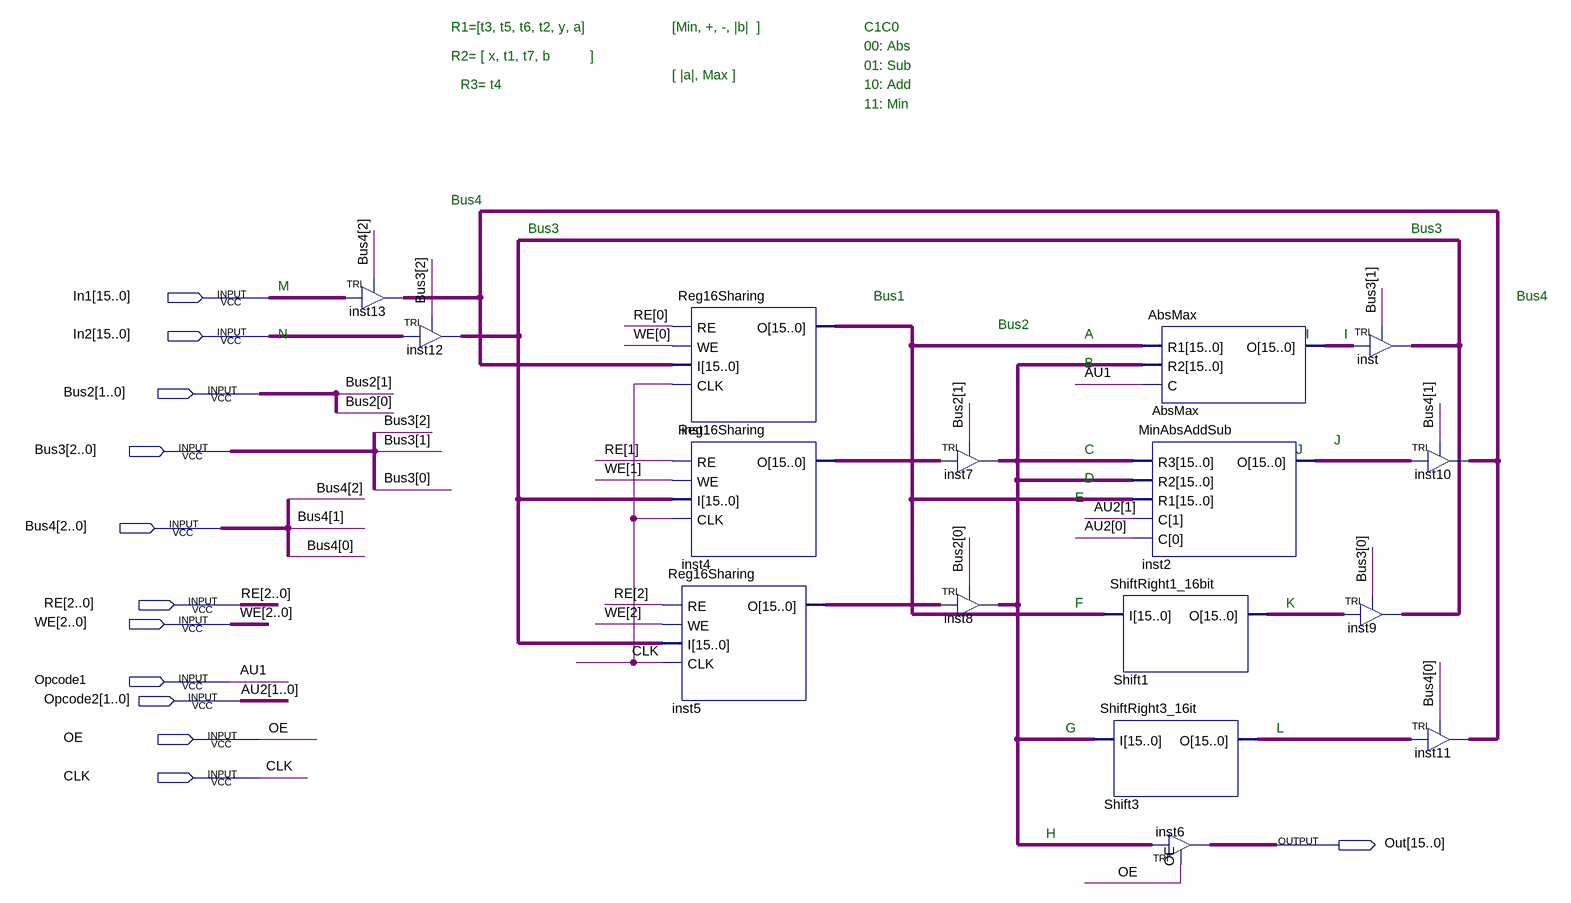
[diagram p0: schematic sheet]
// Quartus schematic BusSharingDatapath.bdf as structural Verilog: 16 symbols, 12 pins
module BusSharingDatapath (
  input  [15:0] In1,
  input  [15:0] In2,
  input  [1:0] Bus2,
  input  [2:0] Bus3,
  input  [2:0] Bus4,
  input  [2:0] RE,
  input  [2:0] WE,
  input  Opcode1,
  input  [1:0] Opcode2,
  input  OE,
  input  CLK,
  output [15:0] Out
);

  wire [15:0] AbsMax_o, inst1_o, inst2_o, inst4_o, inst5_o, inst7_out, inst12_out, inst13_out, Shift1_o,
       Shift3_o;

  TRI inst13[15:0] (.IN(In1), .OE(Bus4[2]), .OUT(inst13_out));
  TRI inst12[15:0] (.IN(In2), .OE(Bus3[2]), .OUT(inst12_out));
  Reg16Sharing inst1 (.RE(RE[0]), .WE(WE[0]), .I(inst13_out), .CLK(CLK), .O(inst1_o));
  Reg16Sharing inst4 (.RE(RE[1]), .WE(WE[1]), .I(inst12_out), .CLK(CLK), .O(inst4_o));
  Reg16Sharing inst5 (.RE(RE[2]), .WE(WE[2]), .I(inst12_out), .CLK(CLK), .O(inst5_o));
  TRI inst7[15:0] (.IN(inst4_o), .OE(Bus2[1]), .OUT(inst7_out));
  TRI inst8[15:0] (.IN(inst5_o), .OE(Bus2[0]), .OUT(inst7_out));
  ShiftRight1_16bit Shift1 (.I(inst1_o), .O(Shift1_o));
  ShiftRight3_16it Shift3 (.I(inst7_out), .O(Shift3_o));
  AbsMax AbsMax (.R1(inst1_o), .R2(inst7_out), .C(Opcode1), .O(AbsMax_o));
  MinAbsAddSub inst2 (.R3(inst7_out), .R2(inst7_out), .R1(inst1_o), .C(Opcode2), .O(inst2_o));
  TRI inst6[15:0] (.IN(inst7_out), .OE(OE), .OUT(Out));
  TRI inst[15:0] (.IN(AbsMax_o), .OE(Bus3[1]), .OUT(inst12_out));
  TRI inst10[15:0] (.IN(inst2_o), .OE(Bus4[1]), .OUT(inst13_out));
  TRI inst9[15:0] (.IN(Shift1_o), .OE(Bus3[0]), .OUT(inst12_out));
  TRI inst11[15:0] (.IN(Shift3_o), .OE(Bus4[0]), .OUT(inst13_out));

  // Other names for the same wires on the sheet: AU1 = Opcode1; AU2[1:0] = Opcode2

  // Notes on the sheet:
  //   R1=[t3, t5, t6, t2, y, a]            
  //   [Min, +, -, |b|  ]
  //   C1C0
  //   00: Abs
  //   R2= [ x, t1, t7, b          ]
  //   01: Sub
  //   [ |a|, Max ]   
  //   R3= t4             
  //   10: Add
  //   11: Min
  //   Bus4
  //   Bus3
  //   Bus3
  //   M
  //   Bus1
  //   Bus4
  //   Bus2
  //   N
  //   A
  //   I
  //   I
  //   B
  //   J
  //   C
  //   J
  //   D
  //   E
  //   F
  //   K
  //   G
  //   L
  //   H
endmodule
